# Altium schematic sheet woda.SchDoc
size A4
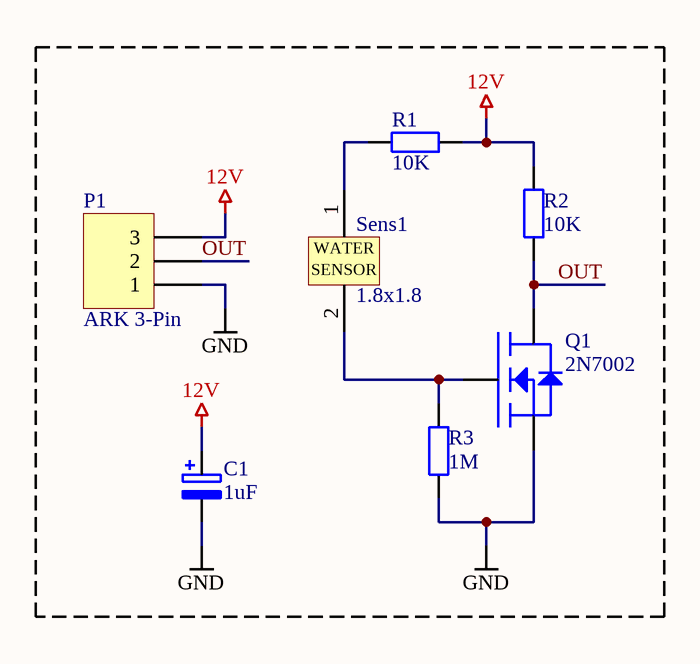
[diagram p0: woda.SchDoc]

## Parts
C1  1uF  [TANC_A]
P1  ARK 3-Pin  [ARK-3.5mm-3pin]
Q1  2N7002  [SOT23]
R1  10K  [R0805]
R2  10K  [R0805]
R3  1M  [R0805]
Sens1  1.8x1.8  [water_sensor]

## Nets
12V: C1.1 P1.3 R1.1 R2.2
GND: C1.2 P1.1 Q1.2(S) R3.1
OUT: P1.2 Q1.3(D) R2.1
NetQ1_1: Q1.1(G) R3.2 Sens1.2
NetR1_2: R1.2 Sens1.1

## Notes on the sheet
- (in symbol Water_sensor_1) WATER; SENSOR

## Library data of the parts
C1 = Cap_Pol: Capacitor Polarized
Q1 = 2N7002(GSD): N-MOSFET
R1-R3 = Res: Resistor
Sens1 = Water_sensor_1